# EasyEDA schematic circuito_prueba_easyeda.json
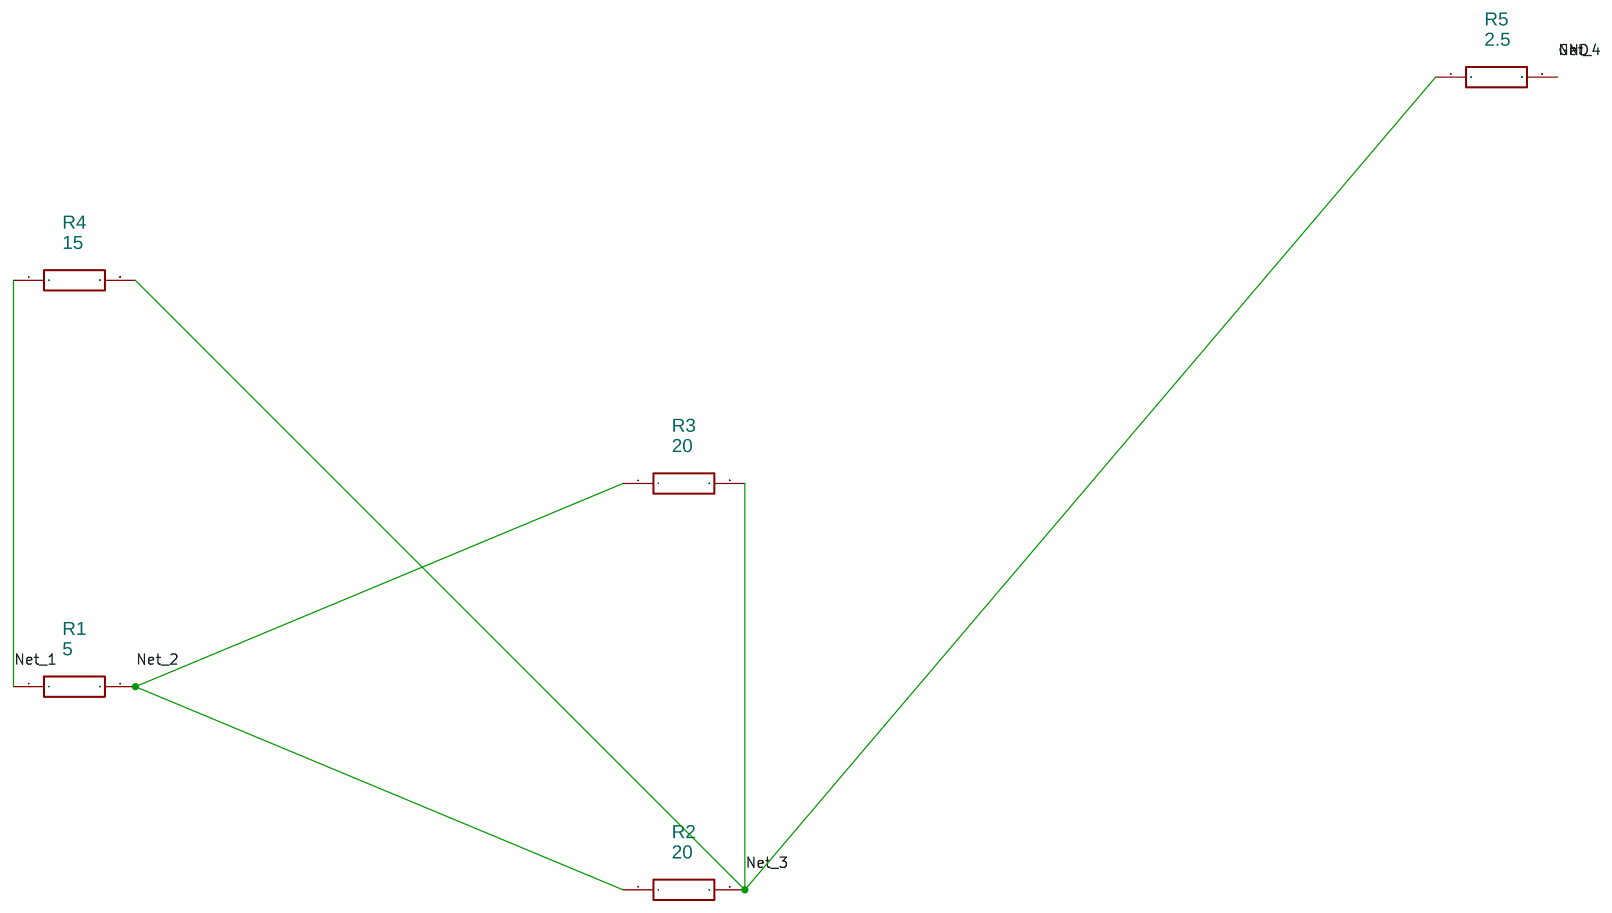
[diagram p0: schematic sheet]

## Parts
R1  5  [C17414]
R2  20  [C17414]
R3  20  [C17414]
R4  15  [C17414]
R5  2.5  [C17414]

## Library data of the parts
R1-R5 = Resistor

## Nets
Net_1: R1.1 R4.1
Net_3: R2.2 R3.2 R4.2 R5.1
Net-(R1-2): R1.2 R2.1 R3.1

Not connected (* = marked no-connect by the designer): R5 2
